# Altium schematic sheet Core-ESP32.SchDoc
size A4; SheetNumber: 6; SheetTotal: 7
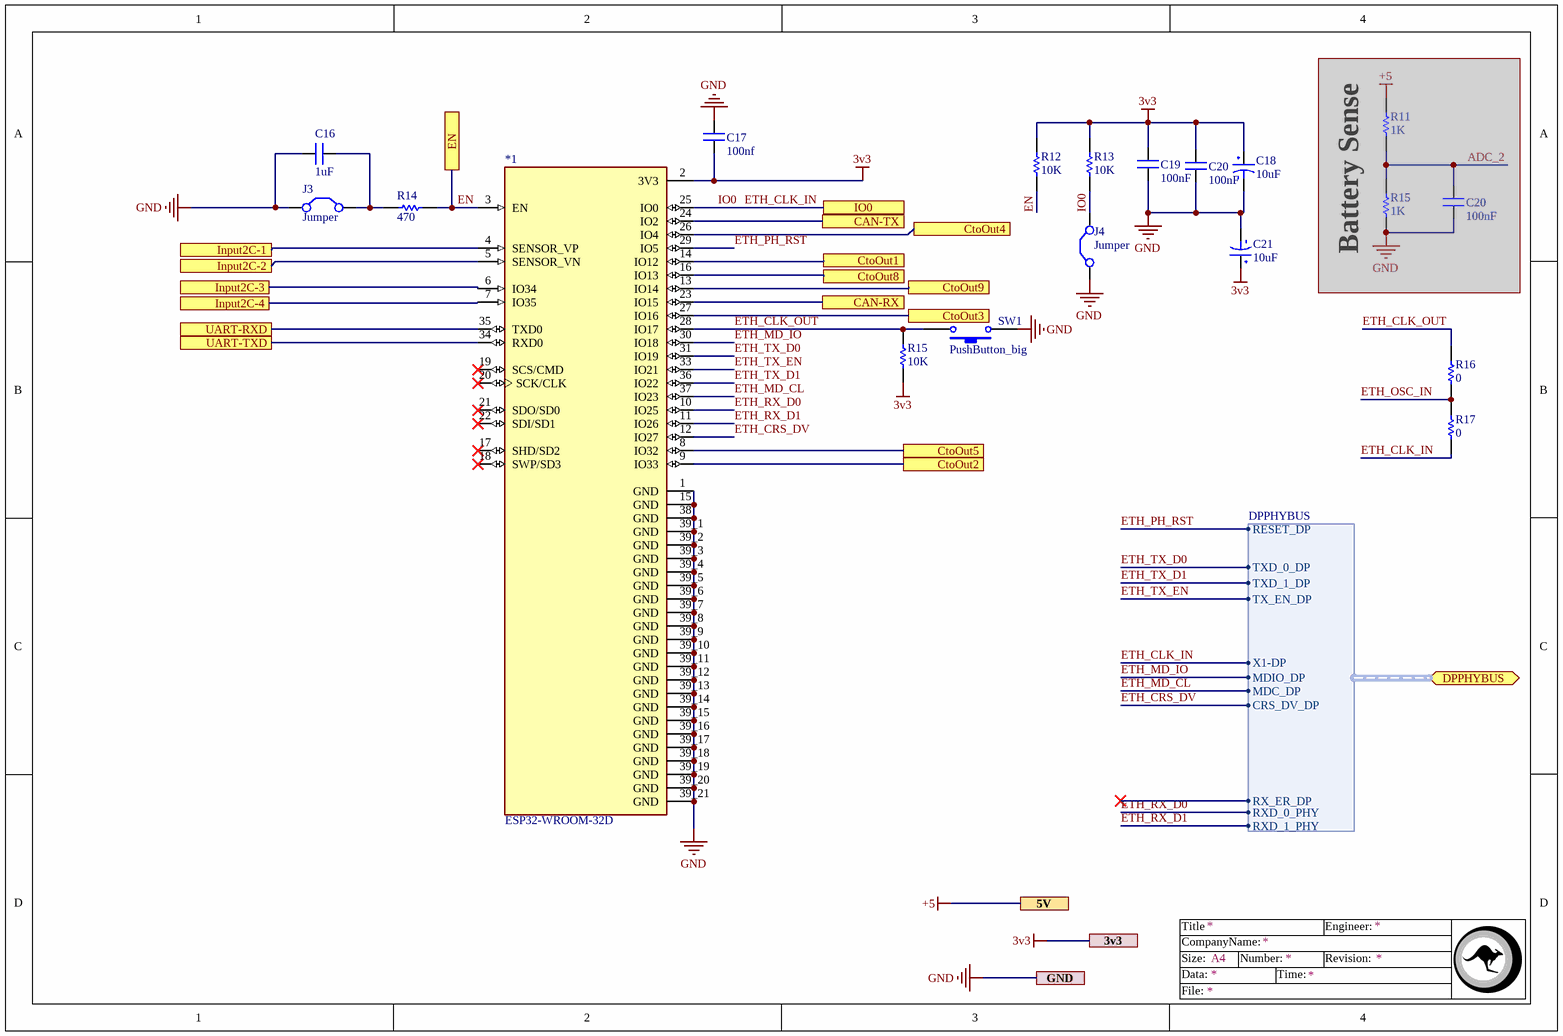
[diagram p0: Core-ESP32.SchDoc]

## Parts
(Parts that share a designator on the sheet are numbered #1, #2 ... from top to bottom, then left to right.)
*1  ESP32-WROOM-32D  [ESP32-Wroom-32D]
C16  1uF  [Cap0805]
C17  100nf  [Cap0805]
C18  10uF  [CAPMOL_B]
C19  100nF  [Cap0805]
C20#1  100nF  [Cap0805]
C20#2  100nF  [Cap0805]  (masked out: inside a compile mask, not in the netlist)
C21  10uF  [CAPMOL_B]
J3  Jumper  [Jumper Small - 2.54 - Blue]
J4  Jumper  [Jumper]
R11  1K  [R0805]  (masked out: inside a compile mask, not in the netlist)
R12  10K  [R0805]
R13  10K  [R0805]
R14  470  [R0805]
R15#1  1K  [R0805]  (masked out: inside a compile mask, not in the netlist)
R15#2  10K  [R0805]
R16  0  [R0805]
R17  0  [R0805]
SW1  PushButton_big  [PushButton]

## Ports
3v3 (see Dashboard - Multifunctional Probe[2C], Ethernet DP[4A], Input - Output[3D], Power Management[3C]), 5V (see Dashboard - Multifunctional Probe[2C], Ethernet DP[4A], Input - Output[3D], Power Management[3B]), CAN-RX (see Dashboard - Multifunctional Probe[2B], CAN[2B]), CAN-TX (see Dashboard - Multifunctional Probe[2B], CAN[2B]), CtoOut1 (see Dashboard - Multifunctional Probe[2B], Input - Output[1C]), CtoOut2 (see Dashboard - Multifunctional Probe[2B], Input - Output[1D]), CtoOut3 (see Dashboard - Multifunctional Probe[2B], Input - Output[1D]), CtoOut4 (see Dashboard - Multifunctional Probe[2B], Input - Output[1D]), CtoOut5 (see Dashboard - Multifunctional Probe[2B], Input - Output[1D]), CtoOut8 (see Dashboard - Multifunctional Probe[2B], Input - Output[1B]), CtoOut9 (see Dashboard - Multifunctional Probe[2B], Input - Output[1C]), DPPHYBUS (bidir, harness DPPHYBUS, see Dashboard - Multifunctional Probe[3C], Ethernet DP[4B]), EN (see Dashboard - Multifunctional Probe[2C], USB2Serial[1C]), GND (see Dashboard - Multifunctional Probe[2C], Ethernet DP[3D], Input - Output[3D], Power Management[3D], USB2Serial[2D]), Input2C-1 (see Dashboard - Multifunctional Probe[2B], Input - Output[4B]), Input2C-2 (see Dashboard - Multifunctional Probe[2C], Input - Output[4B]), Input2C-3 (see Dashboard - Multifunctional Probe[2C], Input - Output[4B]), Input2C-4 (see Dashboard - Multifunctional Probe[2C], Input - Output[4B]), IO0 (see Dashboard - Multifunctional Probe[2C], USB2Serial[1D]), UART-RXD (see Dashboard - Multifunctional Probe[2A], USB2Serial[3B]), UART-TXD (see Dashboard - Multifunctional Probe[2A], USB2Serial[3C])

## Harnesses
DPPHYBUS: RESET_DP, TXD_0_DP, X1-DP, TXD_1_DP, TX_EN_DP, MDIO_DP, MDC_DP, CRS_DV_DP, RX_ER_DP, RXD_0_PHY, RXD_1_PHY

## Nets
3v3: *1.2(3V3) C17.1 C18.2 C19.2 C20#1.2 C21.2 R12.1 R13.1 R15#2.2 ; port 3v3
+5: port 5V
GND: *1.1(GND) *1.15(GND) *1.38(GND) *1.39_1(GND) *1.39_2(GND) *1.39_3(GND) *1.39_4(GND) *1.39_5(GND) *1.39_6(GND) *1.39_7(GND) *1.39_8(GND) *1.39_9(GND) *1.39_10(GND) *1.39_11(GND) *1.39_12(GND) *1.39_13(GND) *1.39_14(GND) *1.39_15(GND) *1.39_16(GND) *1.39_17(GND) *1.39_18(GND) *1.39_19(GND) *1.39_20(GND) *1.39_21(GND) C16.1 C17.2 C18.1 C19.1 C20#1.1 C21.1 J3.1(C1) J4.1(C1) SW1.1 ; port GND
CAN-RX: *1.23(IO15) ; port CAN-RX
CAN-TX: *1.24(IO2) ; port CAN-TX
CtoOut1: *1.14(IO12) ; port CtoOut1
CtoOut2: *1.9(IO33) ; port CtoOut2
CtoOut3: *1.27(IO16) ; port CtoOut3
CtoOut4: *1.26(IO4) ; port CtoOut4
CtoOut5: *1.8(IO32) ; port CtoOut5
CtoOut8: *1.16(IO13) ; port CtoOut8
CtoOut9: *1.13(IO14) ; port CtoOut9
EN: *1.3(EN) R12.2 R14.1 ; port EN
ETH_CLK_IN: *1.25(IO0) J4.2(C2) R13.2 R17.2 ; port IO0, port DPPHYBUS.X1-DP  [also labelled IO0]
ETH_CLK_OUT: *1.28(IO17) R15#2.1 R16.1 SW1.2
ETH_CRS_DV: *1.12(IO27) ; port DPPHYBUS.CRS_DV_DP
ETH_MD_CL: *1.37(IO23) ; port DPPHYBUS.MDC_DP
ETH_MD_IO: *1.30(IO18) ; port DPPHYBUS.MDIO_DP
ETH_OSC_IN: R16.2 R17.1
ETH_PH_RST: *1.29(IO5) ; port DPPHYBUS.RESET_DP
ETH_RX_D0: *1.10(IO25) ; port DPPHYBUS.RXD_0_PHY
ETH_RX_D1: *1.11(IO26) ; port DPPHYBUS.RXD_1_PHY
ETH_TX_D0: *1.31(IO19) ; port DPPHYBUS.TXD_0_DP
ETH_TX_D1: *1.36(IO22) ; port DPPHYBUS.TXD_1_DP
ETH_TX_EN: *1.33(IO21) ; port DPPHYBUS.TX_EN_DP
Input2C-1: *1.4(SENSOR_VP) ; port Input2C-1
Input2C-2: *1.5(SENSOR_VN) ; port Input2C-2
Input2C-3: *1.6(IO34) ; port Input2C-3
Input2C-4: *1.7(IO35) ; port Input2C-4
UART-RXD: *1.35(TXD0) ; port UART-RXD
UART-TXD: *1.34(RXD0) ; port UART-TXD
NetC16_2: C16.2 J3.2(C2) R14.2

Not connected (* = marked no-connect by the designer): *1 17(SHD/SD2)* 18(SWP/SD3)* 19(SCS/CMD)* 20(SCK/CLK)* 21(SDO/SD0)* 22(SDI/SD1)*

## Notes on the sheet
- Battery Sense
- Title
- Size:
- Data:
- CompanyName:
- A4
- Number:
- Time:
- Revision:
- Engineer:
- File:

## Library data of the parts
C16 C17 C19 C20#1 C20#2 = Cap: Surface mount Capacitor
C18 C21 = Cap_P: Polarity
R11-R14 R15#1 R15#2 R16 R17 = Resistor